# EAGLE schematic 5VAC-DC Atmega (EAGLE 9.6.2)
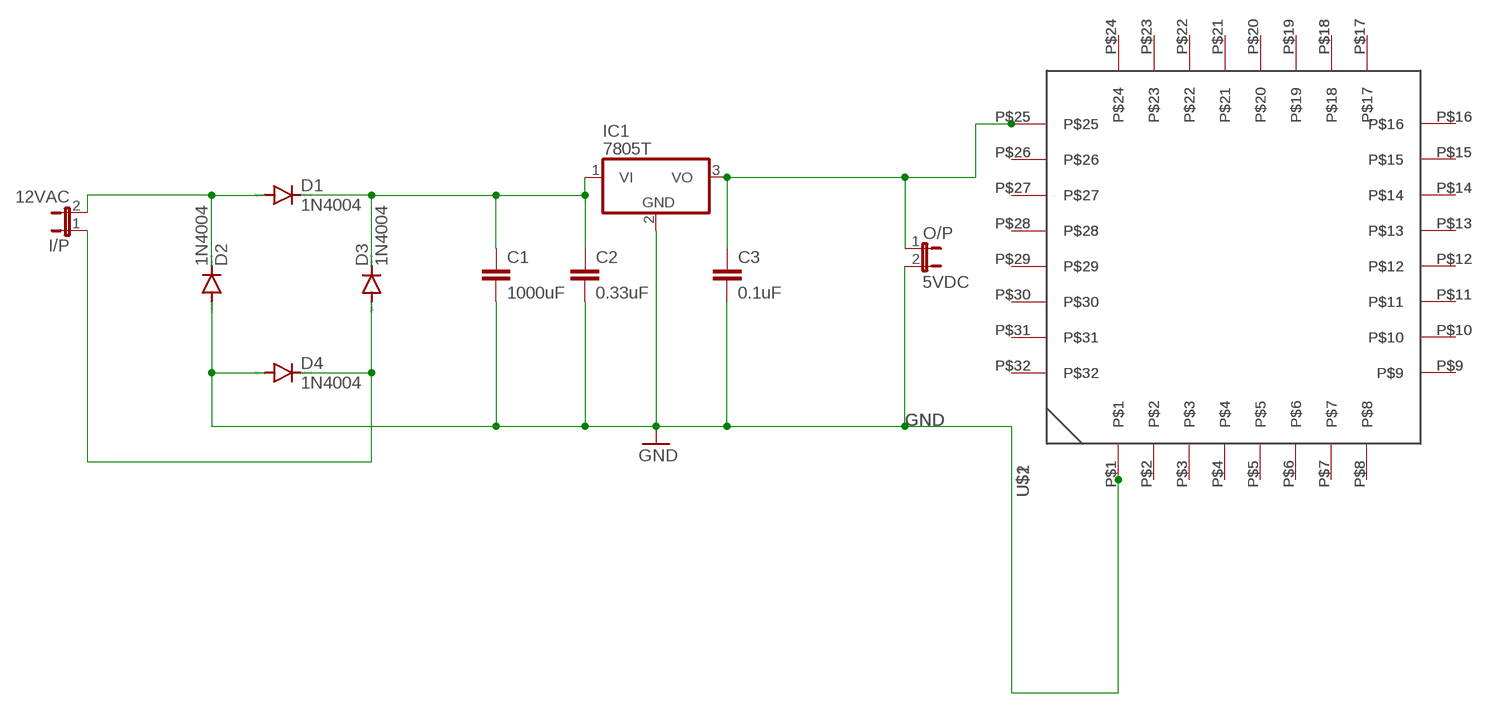
[diagram p0: schematic, sheet 1]

## Parts
C1  1000uF  C2,5-3  [C2.5-3]
C2  0.33uF  C2,5-3  [C2.5-3]
C3  0.1uF  C2,5-3  [C2.5-3]
D1  1N4004  [DO41-10]
D2  1N4004  [DO41-10]
D3  1N4004  [DO41-10]
D4  1N4004  [DO41-10]
I/P  12VAC  JP1E  [JP1]
IC1  7805T  [TO220H]
O/P  5VDC  JP1E  [JP1]
U$1  MEGA8L-DEV  [TQFP-MEGA8L]
U$2  MEGA8L-DEV  [TQFP-MEGA8L]

## Nets
GND: C1.2 C2.2 C3.2 D2.A D4.A IC1.2(GND) O/P.2 U$1.P$1 U$2.P$1
N$1: D1.A D2.C I/P.2
N$2: U$1.P$2 U$2.P$2
N$3: U$1.P$3 U$2.P$3
N$4: C1.1 C2.1 D1.C D3.C IC1.1(VI)
N$5: C3.1 IC1.3(VO) O/P.1 U$1.P$25 U$2.P$25
N$6: U$1.P$4 U$2.P$4
N$7: D3.A D4.C I/P.1
N$8: U$1.P$5 U$2.P$5
N$9: U$1.P$6 U$2.P$6
N$10: U$1.P$7 U$2.P$7
N$11: U$1.P$8 U$2.P$8
N$12: U$1.P$9 U$2.P$9
N$13: U$1.P$10 U$2.P$10
N$14: U$1.P$11 U$2.P$11
N$15: U$1.P$12 U$2.P$12
N$16: U$1.P$13 U$2.P$13
N$17: U$1.P$14 U$2.P$14
N$18: U$1.P$15 U$2.P$15
N$19: U$1.P$16 U$2.P$16
N$20: U$1.P$17 U$2.P$17
N$21: U$1.P$18 U$2.P$18
N$22: U$1.P$19 U$2.P$19
N$23: U$1.P$20 U$2.P$20
N$24: U$1.P$21 U$2.P$21
N$25: U$1.P$22 U$2.P$22
N$26: U$1.P$23 U$2.P$23
N$27: U$1.P$24 U$2.P$24
N$29: U$1.P$26 U$2.P$26
N$30: U$1.P$27 U$2.P$27
N$31: U$1.P$28 U$2.P$28
N$32: U$1.P$29 U$2.P$29
N$33: U$1.P$30 U$2.P$30
N$34: U$1.P$31 U$2.P$31
N$35: U$1.P$32 U$2.P$32

## Library data of the parts
C1-C3 = capacitor-wima:C: CAPACITOR naming: grid - package width
D1-D4 = diode:1N4004: DIODE general purpose rectifier, 1 A
I/P O/P = jumper:JP1E: JUMPER
IC1 = linear:78*: Positive VOLTAGE REGULATOR Source: http://cache.national.com/ds/LM/LM78L05.pdf http://www.fairchildsemi.com/ds/LM/LM7805.pdf
U$1 U$2 = atmega8l:MEGA8L-DEV